# Altium schematic sheet Power.SchDoc
size A4; Organization: Altium Limited; Address1: L3, 12a Rodborough Rd; Address2: Frenchs Forest; Address3: NSW; Address4: Australia 2086
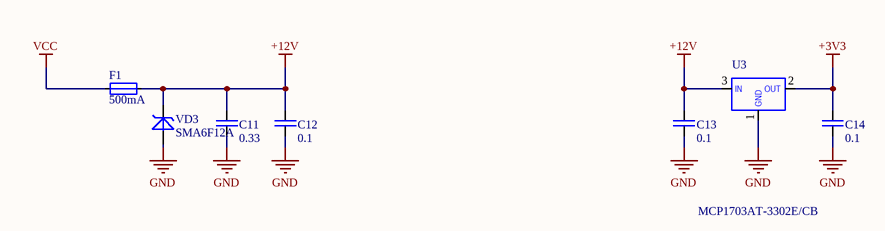
[diagram p0: Power.SchDoc]

## Parts
C11  0.33  [CAP_0805]
C12  0.1  [CAP_0805]
C13  0.1  [CAP_0805]
C14  0.1  [CAP_0805]
F1  500mA  [SMD_1206]
U3  MCP1703AT-3302E/CB  [SOT23-3]
VD3  SMA6F12A  [DO-221AC]

## Nets
+3V3: C14.1 U3.2(OUT)
+12V: C11.1 C12.1 C13.1 F1.1 U3.3(IN) VD3.1
GND: C11.2 C12.2 C13.2 C14.2 U3.1(GND) VD3.2
VCC: F1.2

## Notes on the sheet
- Title
- Size:
- Date:
- A4
- Number:
- Time:
- Revision:
- Sheet
- of
- File:

## Library data of the parts
C11-C14 = C_NONE_POLAR: None polar capacitor; Case: 0805
  C11: Value: 0.33
  C12-C14: Value: 0.1
F1 = FUSE: Resistor; Value: 500mA
U3 = MCP1703A: 250 mA, 16V, Low Quiescent Current LDO Regulator
VD3 = DIOSE_TVS: TVS Diode; Value: SMA6F12A